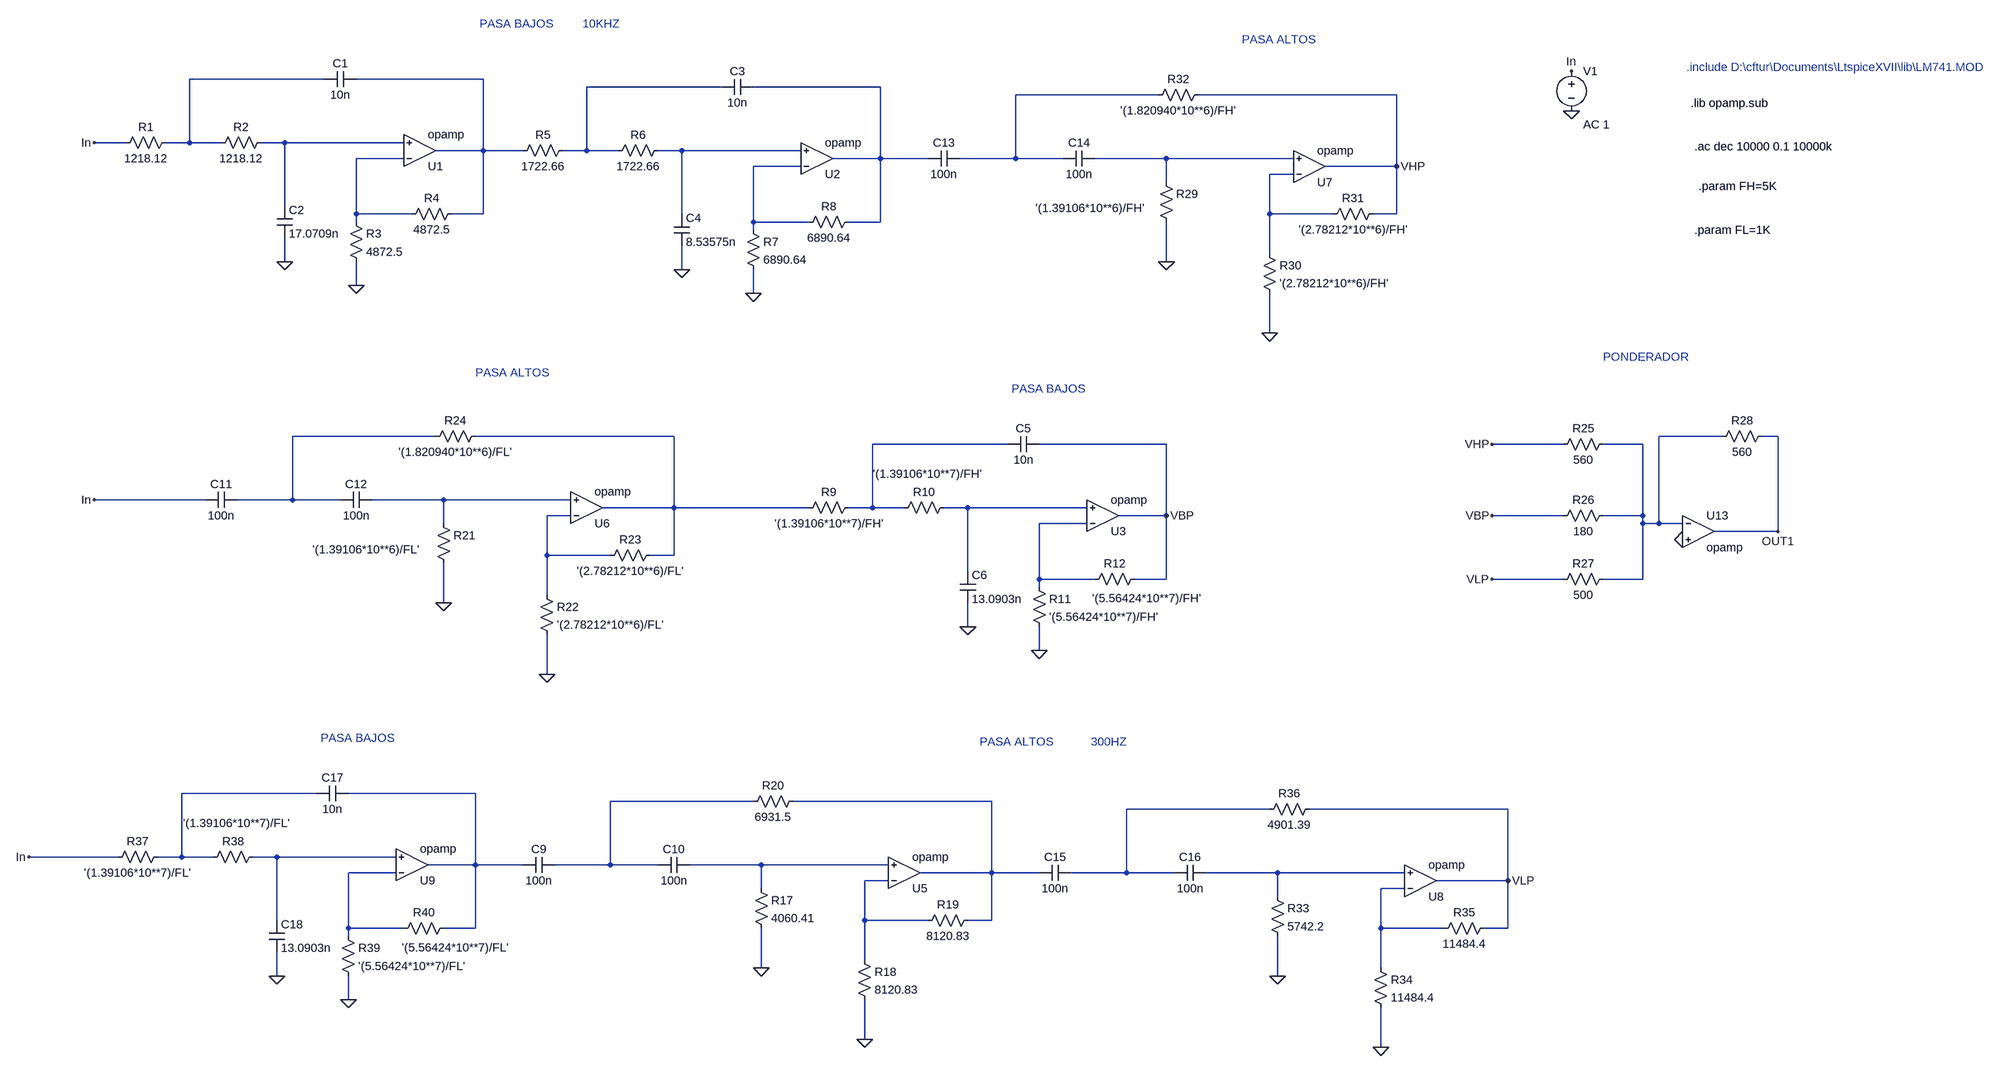
[diagram p0: schematic EcualizadorP1.asc]
EcualizadorP1.asc, the LTspice schematic file:
Version 4
SHEET 1 3640 1556
WIRE -880 -912 -1152 -912
WIRE -560 -912 -816 -912
WIRE -80 -896 -352 -896
WIRE 240 -896 -16 -896
WIRE 800 -880 512 -880
WIRE 1280 -880 880 -880
WIRE -1280 -784 -1344 -784
WIRE -1152 -784 -1152 -912
WIRE -1152 -784 -1200 -784
WIRE -1088 -784 -1152 -784
WIRE -960 -784 -1008 -784
WIRE -720 -784 -960 -784
WIRE -560 -768 -560 -912
WIRE -560 -768 -656 -768
WIRE -480 -768 -560 -768
WIRE -352 -768 -352 -896
WIRE -352 -768 -400 -768
WIRE -288 -768 -352 -768
WIRE -160 -768 -208 -768
WIRE 80 -768 -160 -768
WIRE -720 -752 -816 -752
WIRE 240 -752 240 -896
WIRE 240 -752 144 -752
WIRE 336 -752 240 -752
WIRE 512 -752 512 -880
WIRE 512 -752 400 -752
WIRE 608 -752 512 -752
WIRE 816 -752 672 -752
WIRE 1072 -752 816 -752
WIRE 80 -736 -16 -736
WIRE 1280 -736 1280 -880
WIRE 1280 -736 1136 -736
WIRE 1072 -720 1024 -720
WIRE 816 -704 816 -752
WIRE -960 -656 -960 -784
WIRE -816 -640 -816 -752
WIRE -704 -640 -816 -640
WIRE -560 -640 -560 -768
WIRE -560 -640 -624 -640
WIRE -160 -640 -160 -768
WIRE 1024 -640 1024 -720
WIRE 1152 -640 1024 -640
WIRE 1280 -640 1280 -736
WIRE 1280 -640 1232 -640
WIRE -816 -624 -816 -640
WIRE -16 -624 -16 -736
WIRE 96 -624 -16 -624
WIRE 240 -624 240 -752
WIRE 240 -624 176 -624
WIRE -16 -608 -16 -624
WIRE 1024 -560 1024 -640
WIRE -960 -544 -960 -592
WIRE 816 -544 816 -624
WIRE -160 -528 -160 -576
WIRE -816 -496 -816 -544
WIRE -16 -480 -16 -528
WIRE 1024 -400 1024 -480
WIRE -656 -192 -944 -192
WIRE -176 -192 -576 -192
WIRE 1936 -192 1808 -192
WIRE 2048 -192 2016 -192
WIRE 496 -176 224 -176
WIRE 816 -176 560 -176
WIRE 1616 -176 1472 -176
WIRE 1776 -176 1696 -176
WIRE -1120 -64 -1344 -64
WIRE -944 -64 -944 -192
WIRE -944 -64 -1056 -64
WIRE -848 -64 -944 -64
WIRE -640 -64 -784 -64
WIRE -384 -64 -640 -64
WIRE -176 -48 -176 -192
WIRE -176 -48 -320 -48
WIRE 96 -48 -176 -48
WIRE 224 -48 224 -176
WIRE 224 -48 176 -48
WIRE 288 -48 224 -48
WIRE 416 -48 368 -48
WIRE 656 -48 416 -48
WIRE -384 -32 -432 -32
WIRE 816 -32 816 -176
WIRE 816 -32 720 -32
WIRE 1616 -32 1472 -32
WIRE 1776 -32 1776 -176
WIRE 1776 -32 1696 -32
WIRE -640 -16 -640 -64
WIRE 656 -16 560 -16
WIRE 1776 -16 1776 -32
WIRE 1808 -16 1808 -192
WIRE 1808 -16 1776 -16
WIRE 1856 -16 1808 -16
WIRE 2048 0 2048 -192
WIRE 2048 0 1920 0
WIRE -432 48 -432 -32
WIRE -304 48 -432 48
WIRE -176 48 -176 -48
WIRE -176 48 -224 48
WIRE 416 80 416 -48
WIRE 560 96 560 -16
WIRE 672 96 560 96
WIRE 816 96 816 -32
WIRE 816 96 752 96
WIRE 1616 96 1472 96
WIRE 1776 96 1776 -16
WIRE 1776 96 1696 96
WIRE 560 112 560 96
WIRE -432 128 -432 48
WIRE -640 144 -640 64
WIRE 416 192 416 144
WIRE 560 240 560 192
WIRE -432 288 -432 208
WIRE -896 528 -1168 528
WIRE -576 528 -832 528
WIRE -16 544 -304 544
WIRE 464 544 64 544
WIRE 1024 560 736 560
WIRE 1504 560 1104 560
WIRE -1296 656 -1504 656
WIRE -1168 656 -1168 528
WIRE -1168 656 -1216 656
WIRE -1104 656 -1168 656
WIRE -976 656 -1024 656
WIRE -736 656 -976 656
WIRE -576 672 -576 528
WIRE -576 672 -672 672
WIRE -480 672 -576 672
WIRE -304 672 -304 544
WIRE -304 672 -416 672
WIRE -208 672 -304 672
WIRE 0 672 -144 672
WIRE 256 672 0 672
WIRE -736 688 -832 688
WIRE 464 688 464 544
WIRE 464 688 320 688
WIRE 560 688 464 688
WIRE 736 688 736 560
WIRE 736 688 624 688
WIRE 832 688 736 688
WIRE 1040 688 896 688
WIRE 1296 688 1040 688
WIRE 256 704 208 704
WIRE 1504 704 1504 560
WIRE 1504 704 1360 704
WIRE 0 720 0 672
WIRE 1296 720 1248 720
WIRE 1040 736 1040 688
WIRE -976 784 -976 656
WIRE 208 784 208 704
WIRE 336 784 208 784
WIRE 464 784 464 688
WIRE 464 784 416 784
WIRE -832 800 -832 688
WIRE -720 800 -832 800
WIRE -576 800 -576 672
WIRE -576 800 -640 800
WIRE 1248 800 1248 720
WIRE 1376 800 1248 800
WIRE 1504 800 1504 704
WIRE 1504 800 1456 800
WIRE -832 816 -832 800
WIRE 208 864 208 784
WIRE 0 880 0 800
WIRE 1248 880 1248 800
WIRE -976 896 -976 848
WIRE 1040 896 1040 816
WIRE -832 944 -832 896
WIRE 208 1024 208 944
WIRE 1248 1040 1248 960
FLAG 1472 -176 VHP
FLAG 1472 -32 VBP
FLAG 1472 96 VLP
FLAG 1856 16 0
FLAG 2048 0 OUT1
FLAG 1632 -928 In
FLAG 1632 -848 0
FLAG -960 -544 0
FLAG -816 -496 0
FLAG -160 -528 0
FLAG -16 -480 0
FLAG 416 192 0
FLAG 560 240 0
FLAG 0 880 0
FLAG 208 1024 0
FLAG 816 -544 0
FLAG 1024 -400 0
FLAG 1040 896 0
FLAG 1248 1040 0
FLAG -1344 -784 In
FLAG 1280 -736 VHP
FLAG 816 -32 VBP
FLAG 1504 704 VLP
FLAG -640 144 0
FLAG -432 288 0
FLAG -1344 -64 In
FLAG -976 896 0
FLAG -832 944 0
FLAG -1504 656 In
SYMBOL res 1712 -192 R90
WINDOW 0 0 56 VBottom 2
WINDOW 3 32 56 VTop 2
SYMATTR InstName R25
SYMATTR Value 560
SYMBOL res 1712 -48 R90
WINDOW 0 0 56 VBottom 2
WINDOW 3 32 56 VTop 2
SYMATTR InstName R26
SYMATTR Value 180
SYMBOL res 1712 80 R90
WINDOW 0 0 56 VBottom 2
WINDOW 3 32 56 VTop 2
SYMATTR InstName R27
SYMATTR Value 500
SYMBOL res 2032 -208 R90
WINDOW 0 0 56 VBottom 2
WINDOW 3 32 56 VTop 2
SYMATTR InstName R28
SYMATTR Value 560
SYMBOL Opamps\\opamp 1888 -64 R0
SYMATTR InstName U13
SYMBOL voltage 1632 -944 R0
WINDOW 123 24 124 Left 2
WINDOW 39 0 0 Left 0
SYMATTR Value2 AC 1
SYMATTR InstName V1
SYMATTR Value ""
SYMBOL res -1184 -800 R90
WINDOW 0 0 56 VBottom 2
WINDOW 3 32 56 VTop 2
SYMATTR InstName R1
SYMATTR Value 1218.12
SYMBOL res -992 -800 R90
WINDOW 0 0 56 VBottom 2
WINDOW 3 32 56 VTop 2
SYMATTR InstName R2
SYMATTR Value 1218.12
SYMBOL cap -816 -928 R90
WINDOW 0 0 32 VBottom 2
WINDOW 3 32 32 VTop 2
SYMATTR InstName C1
SYMATTR Value 10n
SYMBOL cap -976 -656 R0
SYMATTR InstName C2
SYMATTR Value 17.0709n
SYMBOL res -832 -640 R0
SYMATTR InstName R3
SYMATTR Value 4872.5
SYMBOL res -608 -656 R90
WINDOW 0 0 56 VBottom 2
WINDOW 3 32 56 VTop 2
SYMATTR InstName R4
SYMATTR Value 4872.5
SYMBOL Opamps\\opamp -688 -704 M180
SYMATTR InstName U1
SYMBOL res -384 -784 R90
WINDOW 0 0 56 VBottom 2
WINDOW 3 32 56 VTop 2
SYMATTR InstName R5
SYMATTR Value 1722.66
SYMBOL res -192 -784 R90
WINDOW 0 0 56 VBottom 2
WINDOW 3 32 56 VTop 2
SYMATTR InstName R6
SYMATTR Value 1722.66
SYMBOL cap -16 -912 R90
WINDOW 0 0 32 VBottom 2
WINDOW 3 32 32 VTop 2
SYMATTR InstName C3
SYMATTR Value 10n
SYMBOL cap -176 -640 R0
SYMATTR InstName C4
SYMATTR Value 8.53575n
SYMBOL res -32 -624 R0
SYMATTR InstName R7
SYMATTR Value 6890.64
SYMBOL res 192 -640 R90
WINDOW 0 0 56 VBottom 2
WINDOW 3 32 56 VTop 2
SYMATTR InstName R8
SYMATTR Value 6890.64
SYMBOL Opamps\\opamp 112 -688 M180
SYMATTR InstName U2
SYMBOL res 192 -64 R90
WINDOW 0 0 56 VBottom 2
WINDOW 3 32 56 VTop 2
SYMATTR InstName R9
SYMATTR Value '(1.39106*10**7)/FH'
SYMBOL res 384 -64 R90
WINDOW 0 0 56 VBottom 2
WINDOW 3 -68 49 VTop 2
SYMATTR InstName R10
SYMATTR Value '(1.39106*10**7)/FH'
SYMBOL cap 560 -192 R90
WINDOW 0 0 32 VBottom 2
WINDOW 3 32 32 VTop 2
SYMATTR InstName C5
SYMATTR Value 10n
SYMBOL cap 400 80 R0
SYMATTR InstName C6
SYMATTR Value 13.0903n
SYMBOL res 544 96 R0
SYMATTR InstName R11
SYMATTR Value '(5.56424*10**7)/FH'
SYMBOL res 768 80 R90
WINDOW 0 0 56 VBottom 2
WINDOW 3 39 -8 VTop 2
SYMATTR InstName R12
SYMATTR Value '(5.56424*10**7)/FH'
SYMBOL Opamps\\opamp 688 32 M180
SYMATTR InstName U3
SYMBOL cap -416 656 R90
WINDOW 0 0 32 VBottom 2
WINDOW 3 32 32 VTop 2
SYMATTR InstName C9
SYMATTR Value 100n
SYMBOL cap -144 656 R90
WINDOW 0 0 32 VBottom 2
WINDOW 3 32 32 VTop 2
SYMATTR InstName C10
SYMATTR Value 100n
SYMBOL res -16 704 R0
SYMATTR InstName R17
SYMATTR Value 4060.41
SYMBOL res 192 848 R0
SYMATTR InstName R18
SYMATTR Value 8120.83
SYMBOL res 432 768 R90
WINDOW 0 0 56 VBottom 2
WINDOW 3 32 56 VTop 2
SYMATTR InstName R19
SYMATTR Value 8120.83
SYMBOL res 80 528 R90
WINDOW 0 0 56 VBottom 2
WINDOW 3 32 56 VTop 2
SYMATTR InstName R20
SYMATTR Value 6931.5
SYMBOL Opamps\\opamp 288 752 M180
SYMATTR InstName U5
SYMBOL cap 400 -768 R90
WINDOW 0 0 32 VBottom 2
WINDOW 3 32 32 VTop 2
SYMATTR InstName C13
SYMATTR Value 100n
SYMBOL cap 672 -768 R90
WINDOW 0 0 32 VBottom 2
WINDOW 3 32 32 VTop 2
SYMATTR InstName C14
SYMATTR Value 100n
SYMBOL res 800 -720 R0
WINDOW 3 -248 68 Left 2
SYMATTR InstName R29
SYMATTR Value '(1.39106*10**6)/FH'
SYMBOL res 1008 -576 R0
SYMATTR InstName R30
SYMATTR Value '(2.78212*10**6)/FH'
SYMBOL res 1248 -656 R90
WINDOW 0 0 56 VBottom 2
WINDOW 3 32 56 VTop 2
SYMATTR InstName R31
SYMATTR Value '(2.78212*10**6)/FH'
SYMBOL res 896 -896 R90
WINDOW 0 0 56 VBottom 2
WINDOW 3 32 56 VTop 2
SYMATTR InstName R32
SYMATTR Value '(1.820940*10**6)/FH'
SYMBOL Opamps\\opamp 1104 -672 M180
SYMATTR InstName U7
SYMBOL cap 624 672 R90
WINDOW 0 0 32 VBottom 2
WINDOW 3 32 32 VTop 2
SYMATTR InstName C15
SYMATTR Value 100n
SYMBOL cap 896 672 R90
WINDOW 0 0 32 VBottom 2
WINDOW 3 32 32 VTop 2
SYMATTR InstName C16
SYMATTR Value 100n
SYMBOL res 1024 720 R0
SYMATTR InstName R33
SYMATTR Value 5742.2
SYMBOL res 1232 864 R0
SYMATTR InstName R34
SYMATTR Value 11484.4
SYMBOL res 1472 784 R90
WINDOW 0 0 56 VBottom 2
WINDOW 3 32 56 VTop 2
SYMATTR InstName R35
SYMATTR Value 11484.4
SYMBOL res 1120 544 R90
WINDOW 0 0 56 VBottom 2
WINDOW 3 32 56 VTop 2
SYMATTR InstName R36
SYMATTR Value 4901.39
SYMBOL Opamps\\opamp 1328 768 M180
SYMATTR InstName U8
SYMBOL cap -1056 -80 R90
WINDOW 0 0 32 VBottom 2
WINDOW 3 32 32 VTop 2
SYMATTR InstName C11
SYMATTR Value 100n
SYMBOL cap -784 -80 R90
WINDOW 0 0 32 VBottom 2
WINDOW 3 32 32 VTop 2
SYMATTR InstName C12
SYMATTR Value 100n
SYMBOL res -656 -32 R0
WINDOW 3 -248 68 Left 2
SYMATTR InstName R21
SYMATTR Value '(1.39106*10**6)/FL'
SYMBOL res -448 112 R0
SYMATTR InstName R22
SYMATTR Value '(2.78212*10**6)/FL'
SYMBOL res -208 32 R90
WINDOW 0 0 56 VBottom 2
WINDOW 3 32 56 VTop 2
SYMATTR InstName R23
SYMATTR Value '(2.78212*10**6)/FL'
SYMBOL res -560 -208 R90
WINDOW 0 0 56 VBottom 2
WINDOW 3 32 56 VTop 2
SYMATTR InstName R24
SYMATTR Value '(1.820940*10**6)/FL'
SYMBOL Opamps\\opamp -352 16 M180
SYMATTR InstName U6
SYMBOL res -1200 640 R90
WINDOW 0 0 56 VBottom 2
WINDOW 3 32 56 VTop 2
SYMATTR InstName R37
SYMATTR Value '(1.39106*10**7)/FL'
SYMBOL res -1008 640 R90
WINDOW 0 0 56 VBottom 2
WINDOW 3 -68 49 VTop 2
SYMATTR InstName R38
SYMATTR Value '(1.39106*10**7)/FL'
SYMBOL cap -832 512 R90
WINDOW 0 0 32 VBottom 2
WINDOW 3 32 32 VTop 2
SYMATTR InstName C17
SYMATTR Value 10n
SYMBOL cap -992 784 R0
SYMATTR InstName C18
SYMATTR Value 13.0903n
SYMBOL res -848 800 R0
SYMATTR InstName R39
SYMATTR Value '(5.56424*10**7)/FL'
SYMBOL res -624 784 R90
WINDOW 0 0 56 VBottom 2
WINDOW 3 39 -8 VTop 2
SYMATTR InstName R40
SYMATTR Value '(5.56424*10**7)/FL'
SYMBOL Opamps\\opamp -704 736 M180
SYMATTR InstName U9
TEXT 1864 -936 Left 2 ;.include D:\\cftur\\Documents\\LtspiceXVII\\lib\\LM741.MOD
TEXT 1880 -776 Left 2 !.ac dec 10000 0.1 10000k
TEXT 1872 -864 Left 2 !.lib opamp.sub
TEXT -568 -1024 Left 2 ;PASA BAJOS
TEXT 440 424 Left 2 ;PASA ALTOS
TEXT 968 -992 Left 2 ;PASA ALTOS
TEXT -576 -320 Left 2 ;PASA ALTOS
TEXT 504 -288 Left 2 ;PASA BAJOS
TEXT -360 -1024 Left 2 ;10KHZ
TEXT 664 424 Left 2 ;300HZ
TEXT 1888 -696 Left 2 !.param FH=5K
TEXT 1880 -608 Left 2 !.param FL=1K
TEXT -888 416 Left 2 ;PASA BAJOS
TEXT 1696 -352 Left 2 ;PONDERADOR

The netlist it stands for:
* EcualizadorP1.asc
R25 N014 VHP 560
R26 N014 VBP 180
R27 N014 VLP 500
R28 OUT1 N014 560
XU13 N014 0 OUT1 opamp Aol=100K GBW=10Meg  ; pins invin noninvin out
V1 In 0 AC 1
R1 N001 In 1218.12
R2 N006 N001 1218.12
C1 N002 N001 10n
C2 N006 0 17.0709n
R3 N008 0 4872.5
R4 N002 N008 4872.5
XU1 N008 N006 N002 opamp Aol=100K GBW=10Meg  ; pins invin noninvin out
R5 N003 N002 1722.66
R6 N007 N003 1722.66
C3 N004 N003 10n
C4 N007 0 8.53575n
R7 N010 0 6890.64
R8 N004 N010 6890.64
XU2 N010 N007 N004 opamp Aol=100K GBW=10Meg  ; pins invin noninvin out
R9 N015 N013 '(1.39106*10**7)/FH'
R10 N017 N015 '(1.39106*10**7)/FH'
C5 VBP N015 10n
C6 N017 0 13.0903n
R11 N019 0 '(5.56424*10**7)/FH'
R12 VBP N019 '(5.56424*10**7)/FH'
XU3 N019 N017 VBP opamp Aol=100K GBW=10Meg  ; pins invin noninvin out
C9 N022 N021 100n
C10 N026 N022 100n
R17 N026 0 4060.41
R18 N029 0 8120.83
R19 N023 N029 8120.83
R20 N023 N022 6931.5
XU5 N029 N026 N023 opamp Aol=100K GBW=10Meg  ; pins invin noninvin out
C13 N005 N004 100n
C14 N009 N005 100n
R29 N009 0 '(1.39106*10**6)/FH'
R30 N011 0 '(2.78212*10**6)/FH'
R31 VHP N011 '(2.78212*10**6)/FH'
R32 VHP N005 '(1.820940*10**6)/FH'
XU7 N011 N009 VHP opamp Aol=100K GBW=10Meg  ; pins invin noninvin out
C15 N024 N023 100n
C16 N028 N024 100n
R33 N028 0 5742.2
R34 N030 0 11484.4
R35 VLP N030 11484.4
R36 VLP N024 4901.39
XU8 N030 N028 VLP opamp Aol=100K GBW=10Meg  ; pins invin noninvin out
C11 N012 In 100n
C12 N016 N012 100n
R21 N016 0 '(1.39106*10**6)/FL'
R22 N018 0 '(2.78212*10**6)/FL'
R23 N013 N018 '(2.78212*10**6)/FL'
R24 N013 N012 '(1.820940*10**6)/FL'
XU6 N018 N016 N013 opamp Aol=100K GBW=10Meg  ; pins invin noninvin out
R37 N020 In '(1.39106*10**7)/FL'
R38 N025 N020 '(1.39106*10**7)/FL'
C17 N021 N020 10n
C18 N025 0 13.0903n
R39 N027 0 '(5.56424*10**7)/FL'
R40 N021 N027 '(5.56424*10**7)/FL'
XU9 N027 N025 N021 opamp Aol=100K GBW=10Meg  ; pins invin noninvin out
* .include D:\cftur\Documents\LtspiceXVII\lib\LM741.MOD
.ac dec 10000 0.1 10000k
.lib opamp.sub
* PASA BAJOS
* PASA ALTOS
* PASA ALTOS
* PASA ALTOS
* PASA BAJOS
* 10KHZ
* 300HZ
.param FH=5K
.param FL=1K
* PASA BAJOS
* PONDERADOR
.backanno
.end